# EAGLE design LoRaBBPi (EAGLE 9.6.2)
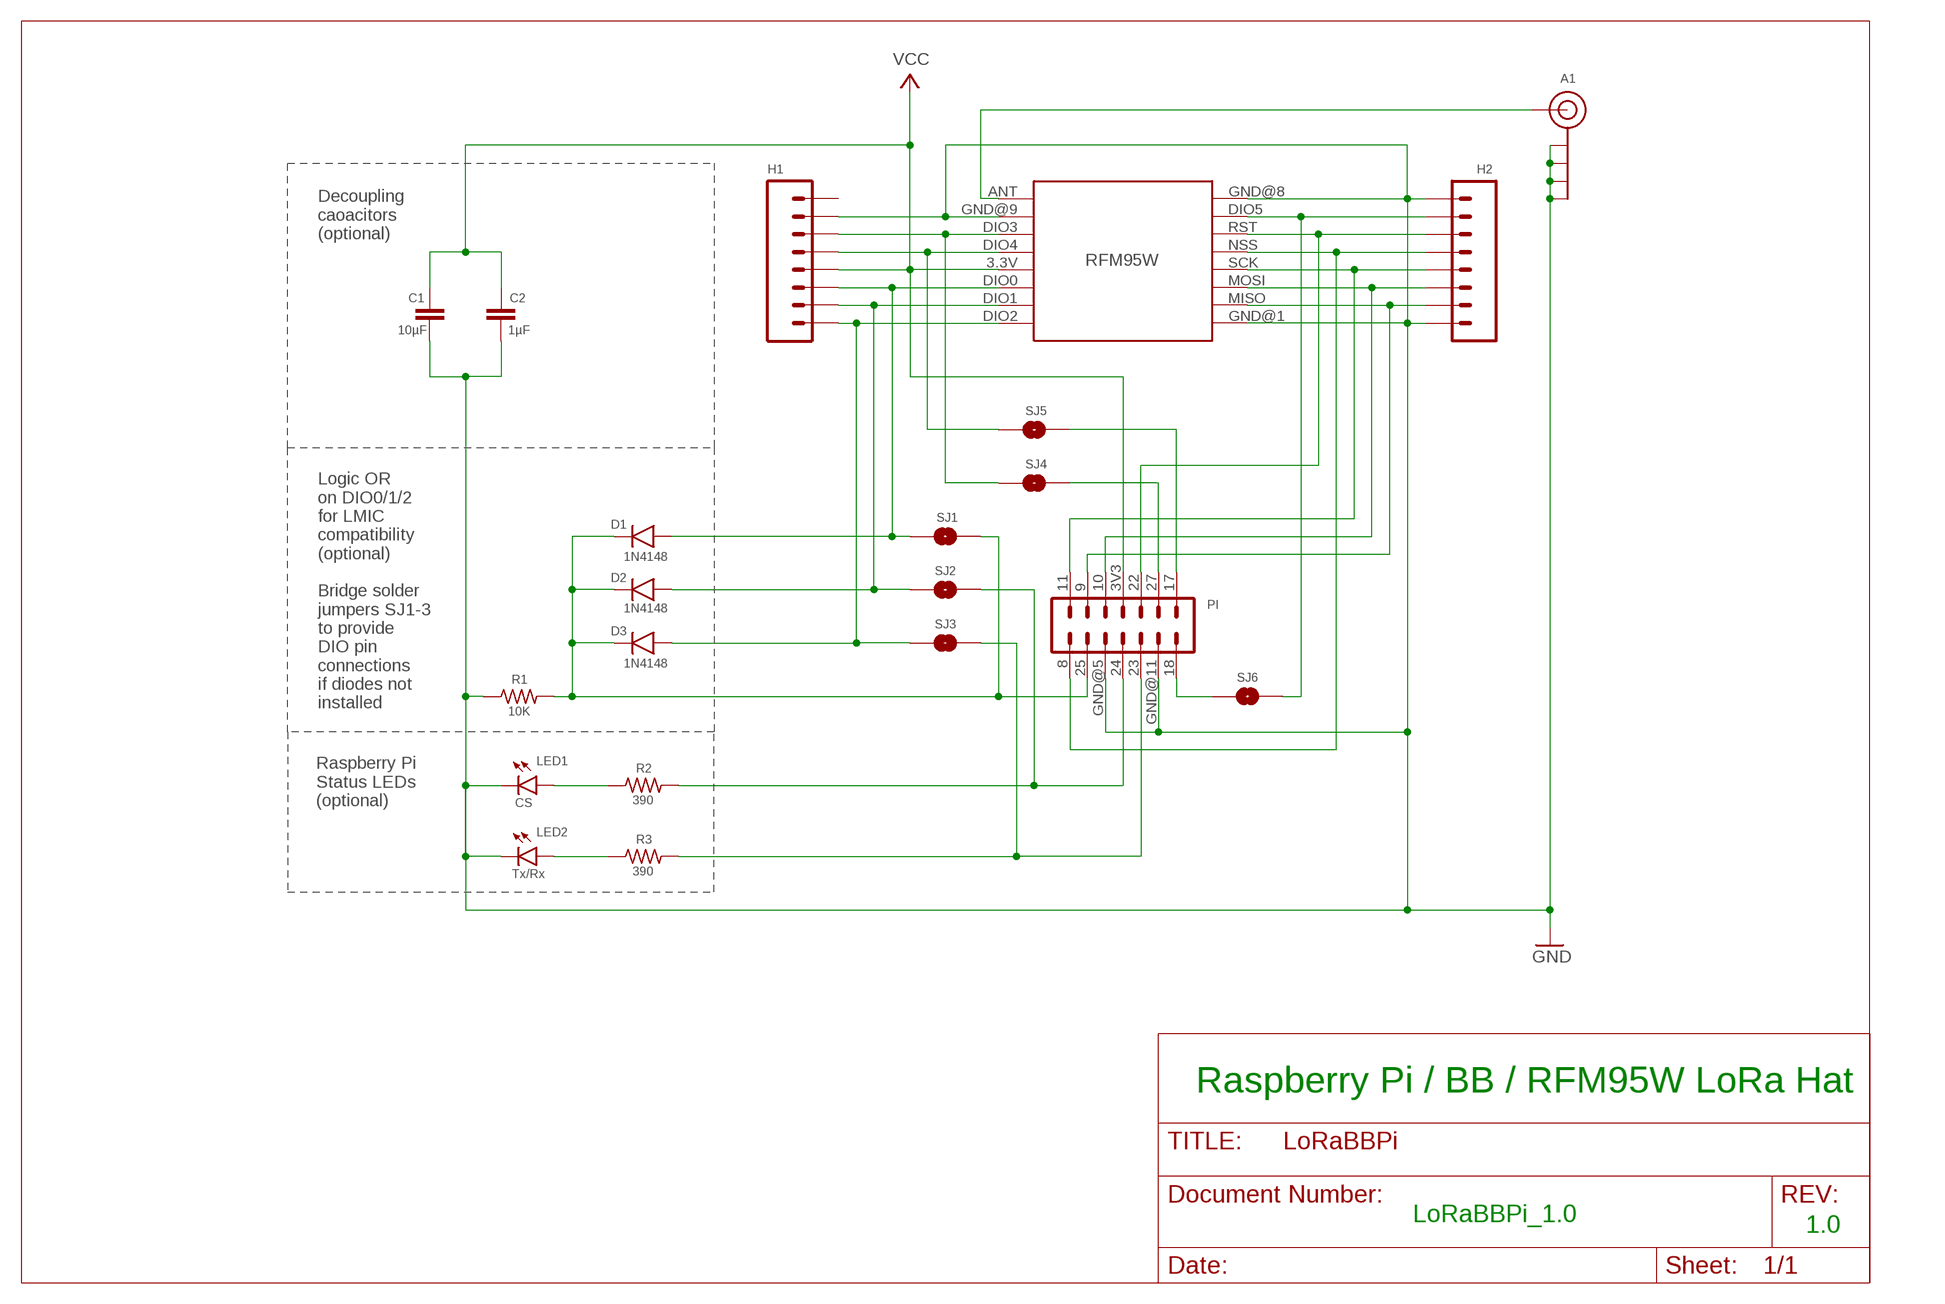
[diagram p0: schematic, sheet 1]

## Parts
A1  U.FL-SMA-EDGE-COMBO  [U.FL-SMA-EDGE-COMBO]
C1  10µF  CAPACITOR  [C0805]
C2  1µF  CAPACITOR  [C0805]
D1  1N4148  1N4148SMD  [SOD-123]
D2  1N4148  1N4148SMD  [SOD-123]
D3  1N4148  1N4148SMD  [SOD-123]
H1  1X8-PIN-HEADER  [1X8]
H2  1X8-PIN-HEADER  [1X8]
LED1  CS  LEDCHIP-LED0805  [CHIP-LED0805]
LED2  Tx/Rx  LEDCHIP-LED0805  [CHIP-LED0805]
PI  2X7-PIN-HEADER  [2X7]
R1  10K  R-US_R0805  [R0805]
R2  390  R-US_R0805  [R0805]
R3  390  R-US_R0805  [R0805]
RFM95W  RFM95W-LORA  [RFM95W-LORA]
SJ1  SJ  [SJ]
SJ2  SJ  [SJ]
SJ3  SJ  [SJ]
SJ4  SJ  [SJ]
SJ5  SJ  [SJ]
SJ6  SJ  [SJ]

## Nets
GND: A1.GND@1A(GND) A1.GND@1B(GND) A1.GND@2A(GND) A1.GND@2B(GND) C1.2 C2.2 H1.2 H2.1 H2.8 LED1.C LED2.C PI.GND@5(GND) PI.GND@11(GND) R1.1 RFM95W.GND@1(GND.1) RFM95W.GND@8(GND.2) RFM95W.GND@9(GND.3)
N$1: LED2.A R3.1
N$2: LED1.A R2.1
N$3: PI.18 SJ6.1
N$4: H2.4 PI.8 RFM95W.NSS
N$5: PI.23 R3.2 SJ3.2
N$6: PI.24 R2.2 SJ2.2
N$7: D1.2 H1.6 RFM95W.DIO0 SJ1.1
N$8: H1.4 RFM95W.DIO4 SJ5.1
N$9: H1.3 RFM95W.DIO3 SJ4.1
N$10: D1.1 D2.1 D3.1 PI.25 R1.2 SJ1.2
N$11: A1.SIG RFM95W.ANT
N$12: D2.2 H1.7 RFM95W.DIO1 SJ2.1
N$13: H2.3 PI.22 RFM95W.RST
N$14: D3.2 H1.8 RFM95W.DIO2 SJ3.1
N$15: H2.5 PI.11 RFM95W.SCK
N$16: H2.6 PI.10 RFM95W.MOSI
N$17: H2.7 PI.9 RFM95W.MISO
N$18: PI.27 SJ4.2
N$19: PI.17 SJ5.2
N$20: H2.2 RFM95W.DIO5 SJ6.2
VCC: C1.1 C2.1 H1.5 PI.3V3 RFM95W.3.3V
Unconnected: H1.1

## Notes on the sheet
- Decoupling
  caoacitors
  (optional)
- Logic OR
  on DIO0/1/2
  for LMIC
  compatibility
  (optional)
  
  Bridge solder
  jumpers SJ1-3
  to provide
  DIO pin
  connections
  if diodes not
  installed
- Raspberry Pi
  Status LEDs
  (optional)
- Raspberry Pi / BB / RFM95W LoRa Hat
- LoRaBBPi_1.0
- 1.0

## Library data of the parts
A1 = digitalconcepts:U.FL-SMA-EDGE-COMBO: Combination u.FL & SMA edge mount antenna
C1 C2 = digitalconcepts:CAPACITOR: 0805 Capacitor
D1-D3 = digitalconcepts:1N4148: 1N4148 SOD-123 Signal Diode
H1 H2 = digitalconcepts:1X8-PIN-HEADER: Single Row 8-Pin Header
LED1 LED2 = led:LED: LED OSRAM: - CHIPLED LG R971, LG N971, LY N971, LG Q971, LY Q971, LO R971, LY R971 LH N974, LH R974 LS Q976, LO Q976, LY Q976 LO Q996 - Hyper CHIPLED LW Q18S LB Q993, LB Q99A, LB R99A - SideLED LS A670, LO A670, LY A670, LG A670, LP A670 LB A673, LV A673, LT A673, LW A673 LH A674 LY A675 LS A676, LA A676, LO A676, LY A676, LW A676 LS A679, LY A679, LG A679 - Hyper Micro SIDELED® LS Y876, LA Y876, LO Y876, LY Y876 LT Y87S - SmartLED LW L88C, LW L88S LB L89C, LB L89S, LG L890 LS L89K, LO L89K, LY L89K LS L896, LA L896, LO L896, LY L896 - TOPLED LS T670, LO T670, LY T670, LG T670, LP T670 LSG T670, LSP T670, LSY T670, LOP T670, LYG T670 LG T671, LOG T671, LSG T671 LB T673, LV T673, LT T673, LW T673 LH T674 LS T676, LA T676, LO T676, LY T676, LB T676, LH T676, LSB T676, LW T676 LB T67C, LV T67C, LT T67C, LS T67K, LO T67K, LY T67K, LW E67C LS E67B, LA E67B, LO E67B, LY E67B, LB E67C, LV E67C, LT E67C LW T67C LS T679, LY T679, LG T679 LS T770, LO T770, LY T770, LG T770, LP T770 LB T773, LV T773, LT T773, LW T773 LH T774 LS E675, LA E675, LY E675, LS T675 LS T776, LA T776, LO T776, LY T776, LB T776 LHGB T686 LT T68C, LB T68C - Hyper Mini TOPLED® LB M676 - Mini TOPLED Santana® LG M470 LS M47K, LO M47K, LY M47K Source: http://www.osram.convergy.de LUXEON: - LUMILED® LXK2-PW12-R00, LXK2-PW12-S00, LXK2-PW14-U00, LXK2-PW14-V00 LXK2-PM12-R00, LXK2-PM12-S00, LXK2-PM14-U00 LXK2-PE12-Q00, LXK2-PE12-R00, LXK2-PE12-S00, LXK2-PE14-T00, LXK2-PE14-U00 LXK2-PB12-K00, LXK2-PB12-L00, LXK2-PB12-M00, LXK2-PB14-N00, LXK2-PB14-P00, LXK2-PB14-Q00 LXK2-PR12-L00, LXK2-PR12-M00, LXK2-PR14-Q00, LXK2-PR14-R00 LXK2-PD12-Q00, LXK2-PD12-R00, LXK2-PD12-S00 LXK2-PH12-R00, LXK2-PH12-S00 LXK2-PL12-P00, LXK2-PL12-Q00, LXK2-PL12-R00 Source: www.luxeon.com KINGBRIGHT: KA-3528ASYC Source: www.kingbright.com
PI = digitalconcepts:2X7-PIN-HEADER: Double Row 14-Pin Header
R1-R3 = digitalconcepts:R-US_: RESISTOR, American symbol; SPICEPREFIX: R
RFM95W = digitalconcepts:RFM95W-LORA: RFM95W LoRa Wireless Transceiver
SJ1-SJ6 = digitalconcepts:SJ: Solder Jumper

## Board
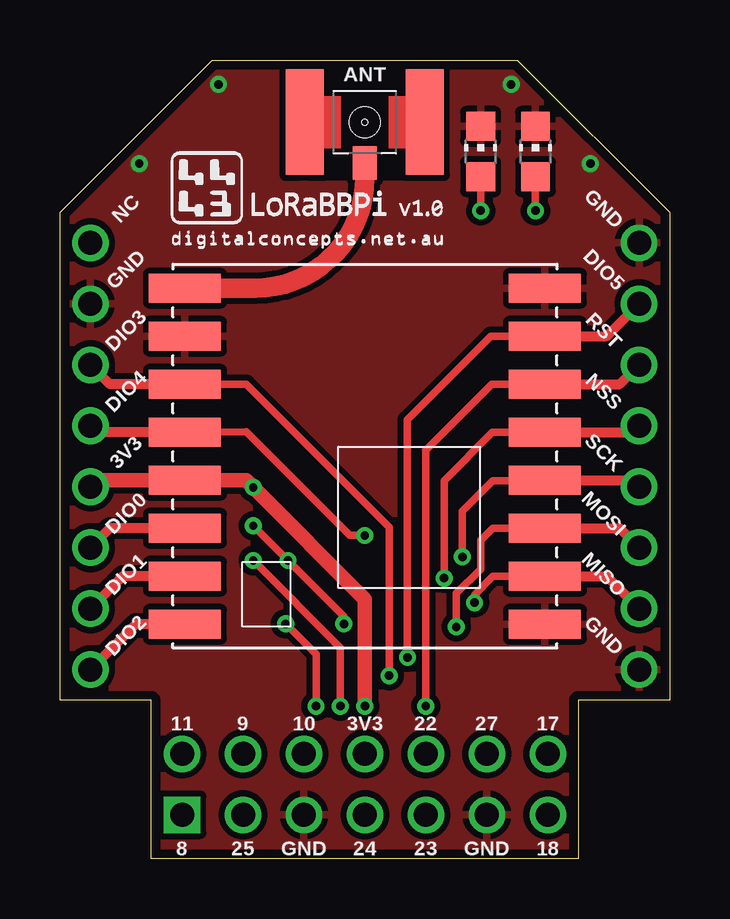
[diagram p1: board, top side]
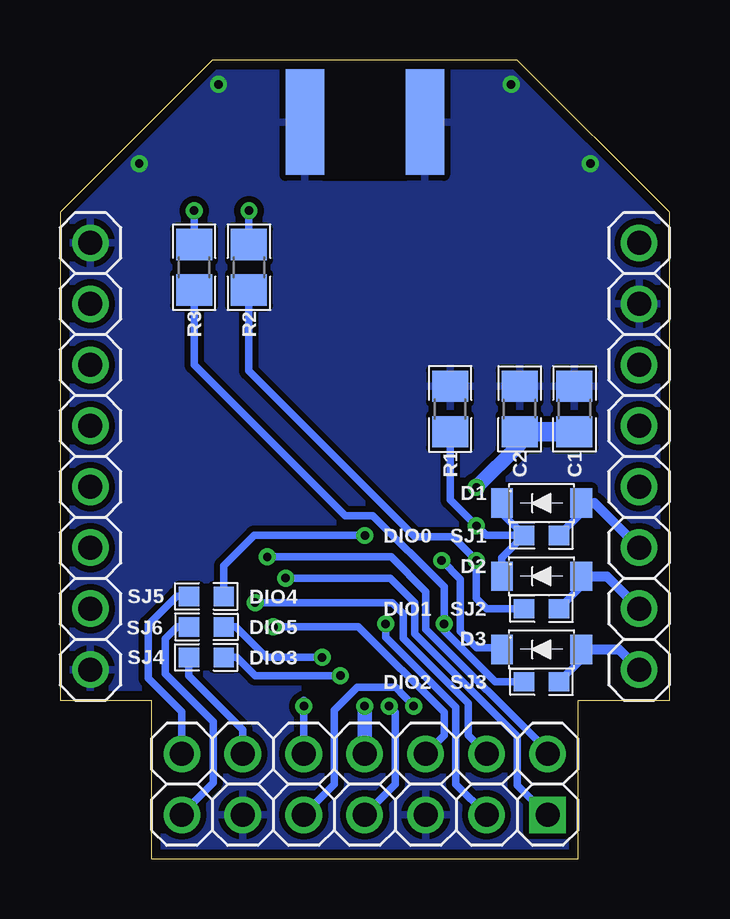
[diagram p2: board, bottom side, seen from below]

Size 25.4 x 33.27 mm. Coordinates in mm from the lower left corner, seen from the top.
Outline: 0,6.6 0,26.92 6.35,33.27 19.05,33.27 25.4,26.92 25.4,6.6 21.59,6.6 21.59,0 3.81,0 3.81,6.6 0,6.6
Copper layers (1*16): Top 0.0356mm / dielectric 1.5011mm / Bottom 0.0356mm
Design rules "PCBs_io": minimum track width 6mil, minimum drill 13mil, track to track 6mil, track to pad 6mil, pad to pad 6mil, via to via 6mil, smd to smd 6mil, copper to edge 15mil, drill to drill 6mil, minimum pad ring 7mil, minimum via ring 7mil, stop-mask expansion 3mil, vias tented up to drill 0mil, thermal gap 10mil

### Footprints (pad centres in the part's own frame; a part is rotated, then mirrored left to right if it is on the bottom)
U.FL-SMA-EDGE-COMBO = smd 1.6 x 4.4: GND@1A -2.5,0; GND@2A 2.5,0 | smd 1.6 x 4.4 bottom: GND@1B -2.5,0; GND@2B 2.5,0 | smd 1 x 1.4: SIG 0,-1.7
C0805 = smd 1.3 x 1.5: 1 -0.95,0; 2 0.95,0
SOD-123 = smd 0.91 x 1.22: 1 1.65,0; 2 -1.65,0
1X8 = drill 1 pad 1.524: 1 0,0; 2 2.54,0; 3 5.08,0; 4 7.62,0; 5 10.16,0; 6 12.7,0; 7 15.24,0; 8 17.78,0
CHIP-LED0805 = smd 1.2 x 1.2: A 0,-1.05; C 0,1.05
2X7 = drill 1 pad 1.524: 3V3 7.62,2.54; 9 2.54,2.54; 10 5.08,2.54; 11 0,2.54; 17 15.24,2.54; 18 15.24,0; 22 10.16,2.54; 23 10.16,0; 24 7.62,0; 25 2.54,0; 27 12.7,2.54; GND@5 5.08,0; GND@11 12.7,0 | drill 1 pad 1.524 square: 8 0,0
R0805 = smd 1.3 x 1.5: 1 -0.95,0; 2 0.95,0
RFM95W-LORA = smd 3 x 1.2: 3.3V 7.5,1; ANT 7.5,-7; DIO0 7.5,3; DIO1 7.5,5; DIO2 7.5,7; DIO3 7.5,-3; DIO4 7.5,-1; DIO5 -7.5,-5; GND@1 -7.5,7; GND@8 -7.5,-7; GND@9 7.5,-5; MISO -7.5,5; MOSI -7.5,3; NSS -7.5,-1; RST -7.5,-3; SCK -7.5,1
SJ = smd 0.85 x 0.8: 1 -0.725,0; 2 0.725,0

### Placement (x,y rotation side)
A1  12.7,30.68 0 top
C1  3.96,18.74 90 bottom
C2  6.25,18.74 90 bottom
D1  5.33,14.81 180 bottom
D2  5.33,11.76 180 bottom
D3  5.33,8.71 180 bottom
H1  1.27,25.65 270 top
H2  24.13,25.65 270 top
LED1  17.53,29.46 0 top
LED2  19.81,29.46 0 top
PI  5.09,1.82 0 top
R1  9.14,18.74 270 bottom
R2  17.53,24.64 270 bottom
R3  19.81,24.64 270 bottom
RFM95W  12.7,16.76 180 top
SJ1  5.33,13.46 180 bottom
SJ2  5.33,10.41 180 bottom
SJ3  5.33,7.37 180 bottom
SJ4  19.3,8.38 180 bottom
SJ5  19.3,10.92 180 bottom
SJ6  19.3,9.65 0 bottom

### Tracks (layer width: path | path; a pad name or v marks a point on that pad's centre or on a via)
GND  (via drill 0.35)
  other vias: 3.3,28.96 6.6,32.26 18.8,32.26 22.1,28.96
  pour Top (isolate 0.254): 6.35,33.27 19.05,33.27 25.4,26.92 25.4,6.6 21.59,6.6 21.59,0 3.81,0 3.81,6.6 0,6.6 0,26.92
  pour Bottom (isolate 0.254): 6.35,33.27 19.05,33.27 25.4,26.92 25.4,6.6 21.59,6.6 21.59,0 3.81,0 3.81,6.6 0,6.6 0,26.92
N$1  (via drill 0.35)
  Top 0.305: LED2.A v19.81,27
  Bottom 0.305: R3.1 v19.81,27
N$2  (via drill 0.35)
  Top 0.305: LED1.A v17.53,27
  Bottom 0.305: R2.1 v17.53,27
N$3
  Bottom 0.305: PI.18 20.32,1.84 19,3.16 19,5.69 21.01,7.7 21.01,9.16 20.52,9.65 SJ6.1
N$4  (via drill 0.35)
  Top 0.305: v16,11.68 16,15.75 18.02,17.76 RFM95W.NSS
  Top 0.406: H2.4 23.86,17.76 RFM95W.NSS
  Bottom 0.305: v16,11.68 11.65,11.68 10.63,10.67 10.63,9.37 6.35,5.09 6.35,3.05 5.12,1.82 PI.8
N$5  (via drill 0.35)
  Top 0.305: v9.4,9.78 10.67,8.51 v10.67,6.35
  Bottom 0.305: SJ3.2 7.27,7.37 9.4,9.49 v9.4,9.78 9.4,11.32 12.36,14.28 13.52,14.28 19.81,20.57 R3.2 | PI.23 13.97,3.1 13.97,6.17 13.01,7.13 11.4,7.13 v10.67,6.35
N$6  (via drill 0.35)
  Top 0.305: v8.05,12.42 11.68,8.79 v11.68,6.35
  Bottom 0.305: SJ2.2 7.62,10.41 8.05,10.85 v8.05,12.42 9.04,13.41 10.61,13.41 17.53,20.32 R2.2 | PI.24 11.43,3.1 11.43,6.1 v11.68,6.35
N$7
  Top 0.406: H1.6 2.08,13.76 RFM95W.DIO0
  Bottom 0.305: D1.2 3.68,14.39 SJ1.1
  Bottom 0.406: D1.2 3.13,14.81 H1.6
N$8  (via drill 0.35)
  Top 0.305: RFM95W.DIO4 7.76,17.78 12.07,13.46 v12.7,13.46
  Top 0.406: H1.4 1.54,17.76 RFM95W.DIO4
  Bottom 0.305: v12.7,13.46 17.32,13.46 18.58,12.2 SJ5.1
N$9  (via drill 0.35)
  Top 0.305: v13.72,7.62 13.72,13.8 7.76,19.76 RFM95W.DIO3
  Top 0.406: H1.3 2.08,19.76 RFM95W.DIO3
  Bottom 0.305: SJ4.1 18.03,8.38 17.27,7.62 v13.72,7.62
N$10  (via drill 0.35)
  Top 0.305: v8.05,13.87 v9.5,12.42 11.83,10.09 v11.83,9.78
  Bottom 0.152: D3.1 7.05,8.78
  Bottom 0.305: v11.83,9.78 11.83,9.22 8.9,6.29 8.9,3.1 PI.25 | SJ1.2 6.98,12.54 D2.1 | D1.1 6.98,14.39 SJ1.2 | 7.05,8.78 8.03,8.78 8.71,9.46 8.71,11.64 v9.5,12.42 | R1.2 9.14,14.96 v8.05,13.87 7.64,13.46 SJ1.2
N$11
  Top 0.813: A1.SIG 12.7,28.35 arc-90 8.11,23.76 RFM95W.ANT
N$12
  Top 0.406: H1.7 2.62,11.76 RFM95W.DIO1
  Bottom 0.305: D2.2 3.68,11.34 SJ2.1
  Bottom 0.406: H1.7 2.62,11.76 D2.2
N$13  (via drill 0.35)
  Top 0.305: v15.24,6.35 15.24,17.02 17.99,19.76 RFM95W.RST
  Top 0.406: H2.3 23.32,19.76 RFM95W.RST
  Bottom 0.305: v15.24,6.35 15.24,6.6 PI.22
N$14
  Top 0.406: H1.8 3.16,9.76 RFM95W.DIO2
  Bottom 0.305: D3.2 3.68,8.29 SJ3.1
  Bottom 0.406: D3.2 2.11,8.71 H1.8
N$15  (via drill 0.35)
  Top 0.305: v16.76,12.57 16.76,14.48 18.03,15.75 20.18,15.75 RFM95W.SCK
  Top 0.406: H2.5 23.86,15.76 RFM95W.SCK
  Bottom 0.305: PI.11 5.09,4.49 10.15,9.56 10.15,11.12 11.6,12.57 v16.76,12.57
N$16  (via drill 0.35)
  Top 0.305: RFM95W.MOSI 18.03,13.76 17.53,13.26 17.53,12.06 16.51,11.05 v16.51,9.65
  Top 0.406: RFM95W.MOSI 23.32,13.76 H2.6
  Bottom 0.305: PI.10 9.4,5.13 9.4,6.1 12.97,9.65 v16.51,9.65
N$17  (via drill 0.35)
  Top 0.305: RFM95W.MISO 18.03,11.76 17.27,11 v17.27,10.67
  Top 0.406: H2.7 22.78,11.76 RFM95W.MISO
  Bottom 0.305: v17.27,10.67 11.56,10.67 11.1,10.21 11.1,9.18 8.39,6.47 8.39,5.13 PI.9
N$18
  Bottom 0.305: PI.27 17.78,5.38 20.03,7.62 SJ4.2
N$19
  Bottom 0.305: PI.17 20.32,6.11 21.72,7.51 21.72,9.73 20.54,10.92 SJ5.2
N$20  (via drill 0.35)
  Top 0.305: RFM95W.DIO5 17.95,21.76 14.48,18.29 v14.48,8.38
  Top 0.406: H2.2 22.79,21.76 RFM95W.DIO5
  Bottom 0.305: SJ6.2 18.07,9.65 16.8,8.38 v14.48,8.38
VCC  (via drill 0.35)
  Top 0.305: 12.7,10.81 12.7,10.8
  Top 0.61: 12.7,10.8 v12.7,6.35 | H1.5 1.54,15.76 RFM95W.3.3V 7.76,15.76 v8.05,15.47 12.7,10.81
  Bottom 0.61: C2.1 6.25,17.27 v8.05,15.47 | PI.3V3 v12.7,6.35
  Bottom 0.813: C1.1 C2.1

### Text on the board
tPlace: ANT | NC | GND | GND | DIO5 | DIO3 | RST | DIO4 | NSS | 3V3 | SCK | DIO0 | MOSI | DIO1 | MISO | DIO2 | GND | 11 | 9 | 10 | 3V3 | 22 | 27 | 17 | 8 | 25 | GND | 24 | 23 | GND | 18
bPlace: DIO0 | DIO4 | DIO1 | DIO5 | DIO3 | DIO2